# EAGLE schematic Fuente_v1 (EAGLE 6.1)
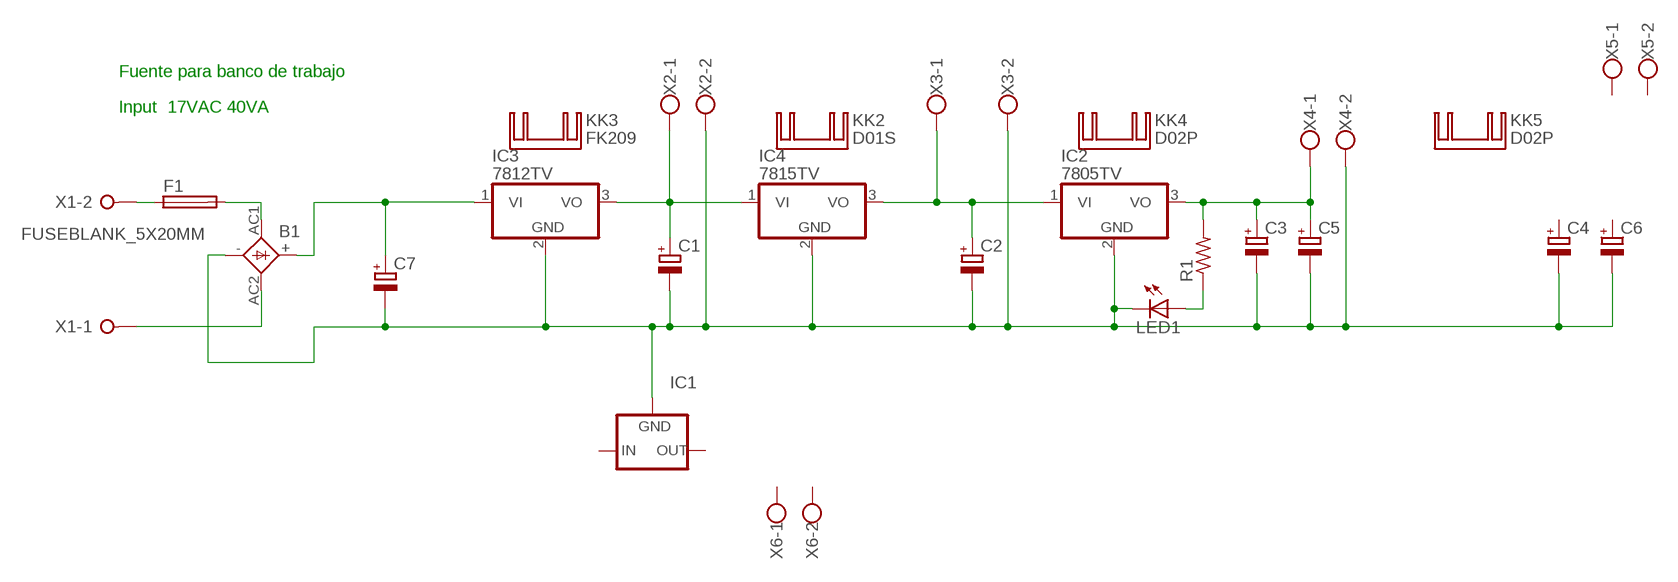
[diagram p0: schematic, sheet 1]

## Parts
B1  S51  [S51]
C1  CPOL-EUE2.5-7  [E2,5-7]
C2  CPOL-EUE2.5-7  [E2,5-7]
C3  CPOL-EUE2.5-7  [E2,5-7]
C4  CPOL-EUE2.5-6  [E2,5-6]
C5  CPOL-EUE2.5-6  [E2,5-6]
C6  CPOL-EUE2.5-6  [E2,5-6]
C7  CPOL-EUE2.5-7  [E2,5-7]
F1  FUSEBLANK_5X20MM  [FUSE_HOLDER_5X20MM]
IC1  79XX-TO3  [TO3-79]
IC2  7805TV  [TO220V]
IC3  7812TV  [TO220V]
IC4  7815TV  [TO220V]
KK2  D01S  [D01S]
KK3  FK209  [FK209]
KK4  D02P  [D02PA]
KK5  D02P  [D02PA]
LED1  LED5MM  [LED5MM]
R1  R-US_0204/7  [0204/7]
X1  W237-02P  [W237-132]
X2  W237-102  [W237-102]
X3  W237-102  [W237-102]
X4  W237-102  [W237-102]
X5  W237-102  [W237-102]
X6  W237-102  [W237-102]

## Nets
N$1: B1.- C1.- C2.- C3.- C4.- C5.- C6.- C7.- IC1.2(GND) IC2.2(GND) IC3.2(GND) IC4.2(GND) LED1.K(C) X2.2 X3.2 X4.2
N$2: B1.+ C7.+ IC3.1(VI)
N$3: C1.+ IC3.3(VO) IC4.1(VI) X2.1
N$4: C2.+ IC2.1(VI) IC4.3(VO) X3.1
N$5: C3.+ C5.+ IC2.3(VO) R1.2 X4.1
N$6: LED1.A R1.1
N$7: B1.AC1 F1.2
N$8: B1.AC2 X1.1
N$9: F1.1 X1.2
Unconnected: C4.+ C6.+ IC1.1(OUT) IC1.3(IN) X5.1 X5.2 X6.1 X6.2

## Notes on the sheet
- Fuente para banco de trabajo
- Input  17VAC 40VA

## Library data of the parts
B1 = rectifier:S51: SEMIKRON RECTIFIER
C1-C7 = rcl:CPOL-EU: POLARIZED CAPACITOR, European symbol
F1 = fuse:FUSE: Fuse; OC_FARNELL: unknown; OC_NEWARK: unknown
IC1 = v-reg:79XX-TO3: VOLTAGE REGULATOR
IC2-IC4 = linear:78*: Positive VOLTAGE REGULATOR Source: http://cache.national.com/ds/LM/LM78L05.pdf http://www.fairchildsemi.com/ds/LM/LM7805.pdf
KK2 = heatsink:D01S: HEATSINK distributor Schukat
KK3 = heatsink:FK209: HEATSINK manufacturer Fischer/distributor Buerklin
KK4 KK5 = heatsink:D02P: HEATSINK distributor Schukat
LED1 = led:LED: LED OSRAM: - CHIPLED LG R971, LG N971, LY N971, LG Q971, LY Q971, LO R971, LY R971 LH N974, LH R974 LS Q976, LO Q976, LY Q976 LO Q996 - Hyper CHIPLED LW Q18S LB Q993, LB Q99A, LB R99A - SideLED LS A670, LO A670, LY A670, LG A670, LP A670 LB A673, LV A673, LT A673, LW A673 LH A674 LY A675 LS A676, LA A676, LO A676, LY A676, LW A676 LS A679, LY A679, LG A679 - Hyper Micro SIDELED® LS Y876, LA Y876, LO Y876, LY Y876 LT Y87S - SmartLED LW L88C, LW L88S LB L89C, LB L89S, LG L890 LS L89K, LO L89K, LY L89K LS L896, LA L896, LO L896, LY L896 - TOPLED LS T670, LO T670, LY T670, LG T670, LP T670 LSG T670, LSP T670, LSY T670, LOP T670, LYG T670 LG T671, LOG T671, LSG T671 LB T673, LV T673, LT T673, LW T673 LH T674 LS T676, LA T676, LO T676, LY T676, LB T676, LH T676, LSB T676, LW T676 LB T67C, LV T67C, LT T67C, LS T67K, LO T67K, LY T67K, LW E67C LS E67B, LA E67B, LO E67B, LY E67B, LB E67C, LV E67C, LT E67C LW T67C LS T679, LY T679, LG T679 LS T770, LO T770, LY T770, LG T770, LP T770 LB T773, LV T773, LT T773, LW T773 LH T774 LS E675, LA E675, LY E675, LS T675 LS T776, LA T776, LO T776, LY T776, LB T776 LHGB T686 LT T68C, LB T68C - Hyper Mini TOPLED® LB M676 - Mini TOPLED Santana® LG M470 LS M47K, LO M47K, LY M47K Source: http://www.osram.convergy.de LUXEON: - LUMILED® LXK2-PW12-R00, LXK2-PW12-S00, LXK2-PW14-U00, LXK2-PW14-V00 LXK2-PM12-R00, LXK2-PM12-S00, LXK2-PM14-U00 LXK2-PE12-Q00, LXK2-PE12-R00, LXK2-PE12-S00, LXK2-PE14-T00, LXK2-PE14-U00 LXK2-PB12-K00, LXK2-PB12-L00, LXK2-PB12-M00, LXK2-PB14-N00, LXK2-PB14-P00, LXK2-PB14-Q00 LXK2-PR12-L00, LXK2-PR12-M00, LXK2-PR14-Q00, LXK2-PR14-R00 LXK2-PD12-Q00, LXK2-PD12-R00, LXK2-PD12-S00 LXK2-PH12-R00, LXK2-PH12-S00 LXK2-PL12-P00, LXK2-PL12-Q00, LXK2-PL12-R00 Source: www.luxeon.com KINGBRIGHT: KA-3528ASYC Source: www.kingbright.com
R1 = rcl:R-US_: RESISTOR, American symbol
X1 = con-wago-508:W237-02P: WAGO SREW CLAMP; OC_FARNELL: unknown; OC_NEWARK: unknown
X2-X6 = con-wago-500:W237-102: WAGO SCREW CLAMP; MPN: 237-102; OC_FARNELL: unknown; OC_NEWARK: 70K9898